# EAGLE design adaptateur_fusible_4N25V (EAGLE 6.5.0)
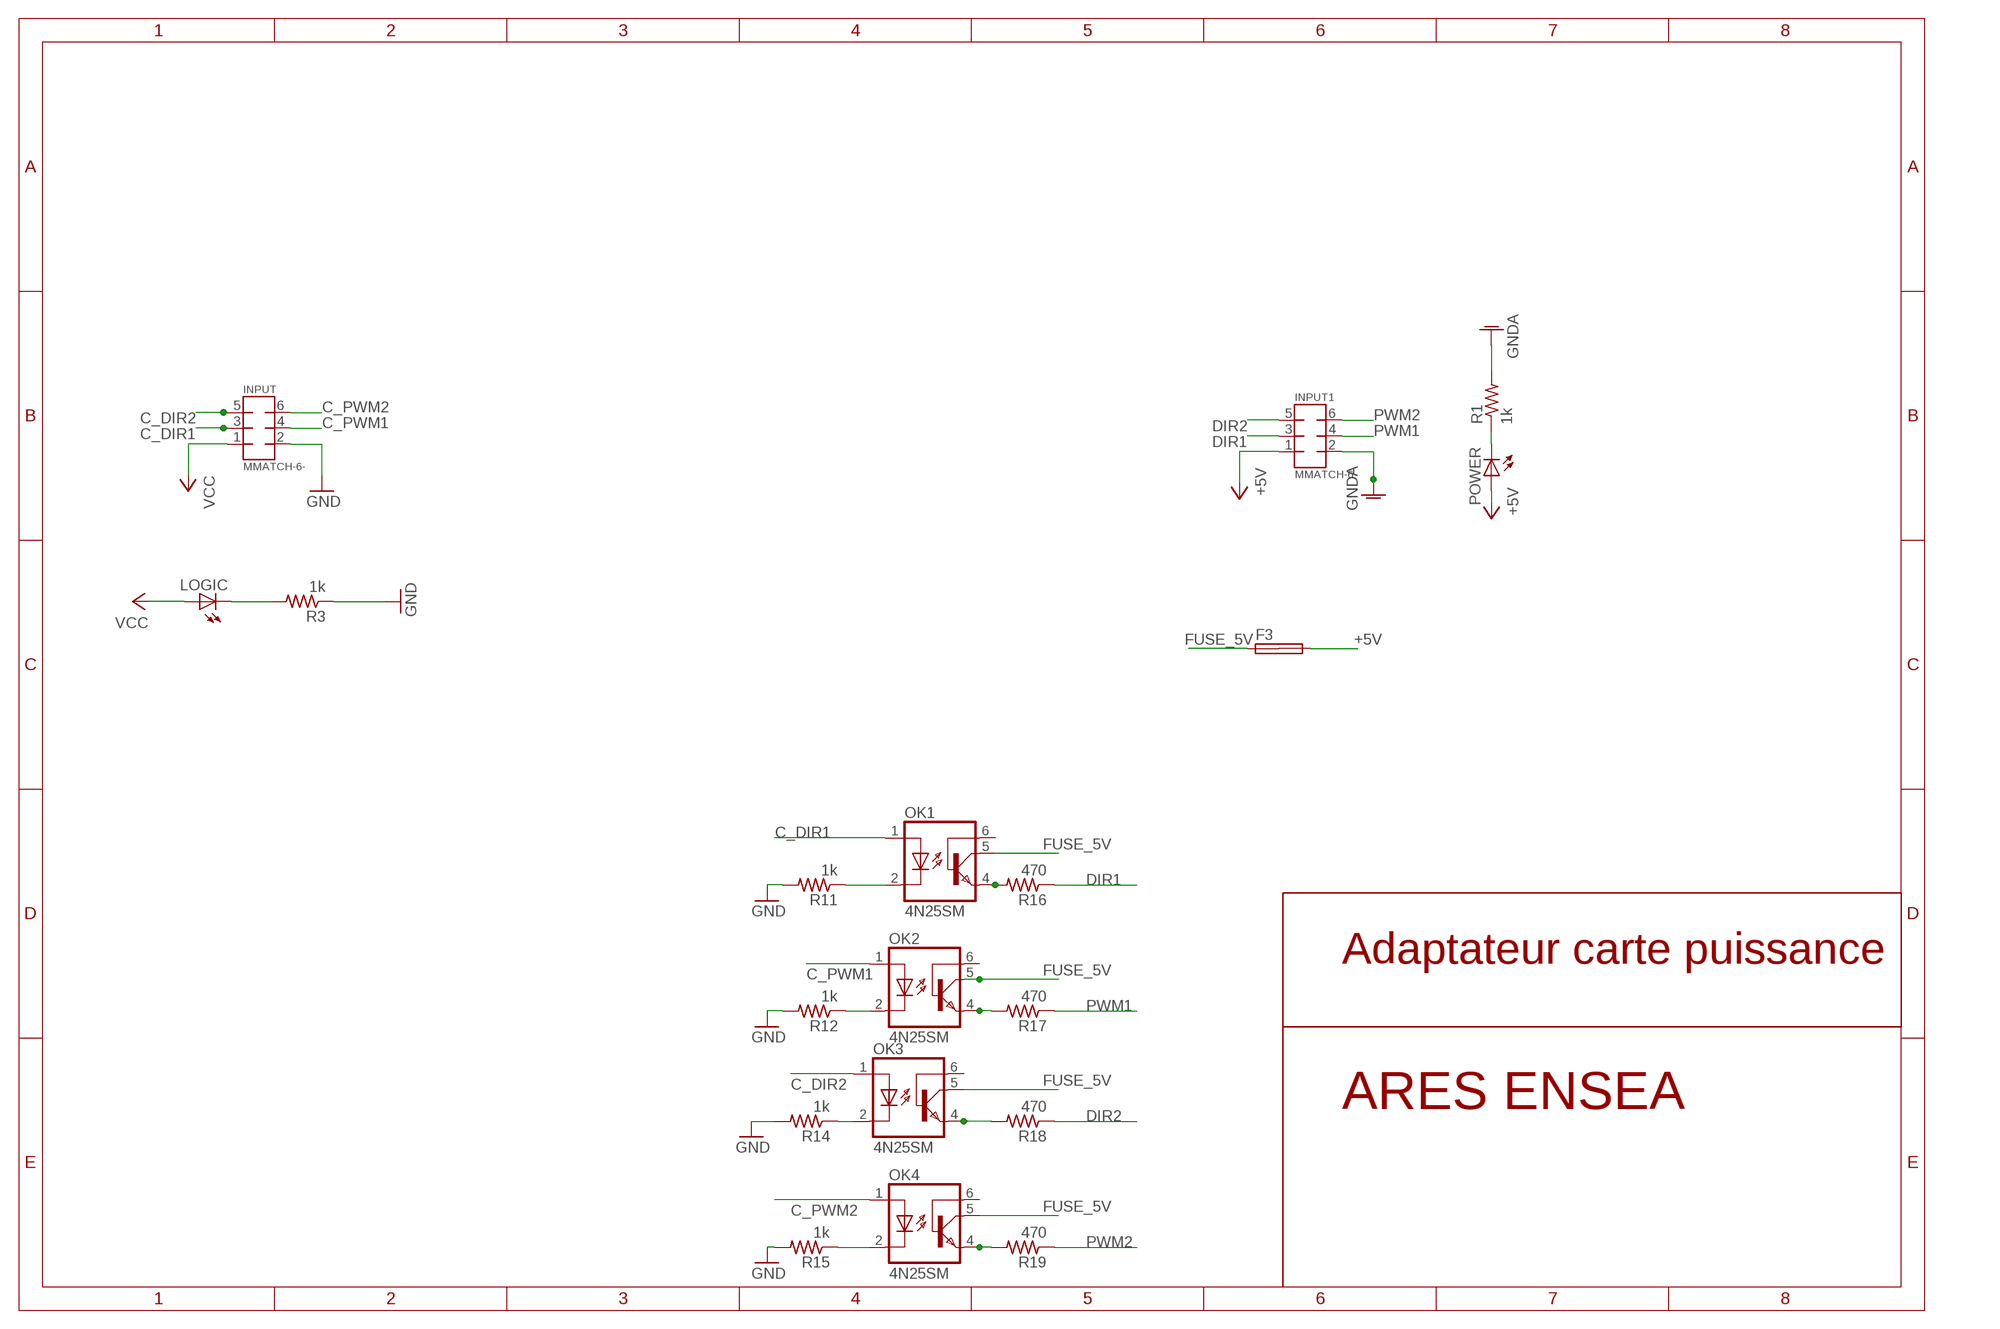
[diagram p0: schematic, sheet 1]

## Parts
F3  SHK20L  [SHK20L]
INPUT  MMATCH-6-  [AMP-215079-6]
INPUT1  MMATCH-6-  [AMP-215079-6]
LOGIC  LEDSML0805  [SML0805]
OK1  4N25SM  [DIL6-SMD]
OK2  4N25SM  [DIL6-SMD]
OK3  4N25SM  [DIL6-SMD]
OK4  4N25SM  [DIL6-SMD]
POWER  LEDSML0805  [SML0805]
R1  1k  R-US_M0805  [M0805]
R3  1k  R-US_M0805  [M0805]
R11  1k  R-US_M0805  [M0805]
R12  1k  R-US_M0805  [M0805]
R14  1k  R-US_M0805  [M0805]
R15  1k  R-US_M0805  [M0805]
R16  470  R-US_M0805  [M0805]
R17  470  R-US_M0805  [M0805]
R18  470  R-US_M0805  [M0805]
R19  470  R-US_M0805  [M0805]

## Nets
+5V: F3.2A INPUT1.1 POWER.A
C_DIR1: INPUT.3 OK1.1(A)
C_DIR2: INPUT.5 OK3.1(A)
C_PWM1: INPUT.4 OK2.1(A)
C_PWM2: INPUT.6 OK4.1(A)
DIR1: INPUT1.3 R16.1
DIR2: INPUT1.5 R18.1
FUSE_5V: F3.1A OK1.5(COL) OK2.5(COL) OK3.5(COL) OK4.5(COL)
GND: INPUT.2 R3.1 R11.2 R12.2 R14.2 R15.2
GNDA: INPUT1.2 R1.2
N$1: OK1.2(C) R11.1
N$2: OK2.2(C) R12.1
N$3: POWER.C R1.1
N$4: LOGIC.C R3.2
N$9: OK3.2(C) R14.1
N$10: OK4.2(C) R15.1
N$19: OK1.4(EMI) R16.2
N$20: OK2.4(EMI) R17.2
N$21: OK3.4(EMI) R18.2
N$22: OK4.4(EMI) R19.2
PWM1: INPUT1.4 R17.1
PWM2: INPUT1.6 R19.1
VCC: INPUT.1 LOGIC.A
Unconnected: F3.1B F3.2B OK1.6(BAS) OK2.6(BAS) OK3.6(BAS) OK4.6(BAS)

## Notes on the sheet
- Adaptateur carte puissance
- ARES ENSEA

## Library data of the parts
F3 = fuse:SHK20L: FUSE HOLDER 5 x 20 mm, SH contact, SHH1 Schukat, E1073 Buerklin; OC_FARNELL: unknown; OC_NEWARK: unknown
INPUT INPUT1 = jt-con-micromatch:MMATCH-6-*
LOGIC POWER = led:LED: LED OSRAM: - CHIPLED LG R971, LG N971, LY N971, LG Q971, LY Q971, LO R971, LY R971 LH N974, LH R974 LS Q976, LO Q976, LY Q976 LO Q996 - Hyper CHIPLED LW Q18S LB Q993, LB Q99A, LB R99A - SideLED LS A670, LO A670, LY A670, LG A670, LP A670 LB A673, LV A673, LT A673, LW A673 LH A674 LY A675 LS A676, LA A676, LO A676, LY A676, LW A676 LS A679, LY A679, LG A679 - Hyper Micro SIDELED® LS Y876, LA Y876, LO Y876, LY Y876 LT Y87S - SmartLED LW L88C, LW L88S LB L89C, LB L89S, LG L890 LS L89K, LO L89K, LY L89K LS L896, LA L896, LO L896, LY L896 - TOPLED LS T670, LO T670, LY T670, LG T670, LP T670 LSG T670, LSP T670, LSY T670, LOP T670, LYG T670 LG T671, LOG T671, LSG T671 LB T673, LV T673, LT T673, LW T673 LH T674 LS T676, LA T676, LO T676, LY T676, LB T676, LH T676, LSB T676, LW T676 LB T67C, LV T67C, LT T67C, LS T67K, LO T67K, LY T67K, LW E67C LS E67B, LA E67B, LO E67B, LY E67B, LB E67C, LV E67C, LT E67C LW T67C LS T679, LY T679, LG T679 LS T770, LO T770, LY T770, LG T770, LP T770 LB T773, LV T773, LT T773, LW T773 LH T774 LS E675, LA E675, LY E675, LS T675 LS T776, LA T776, LO T776, LY T776, LB T776 LHGB T686 LT T68C, LB T68C - Hyper Mini TOPLED® LB M676 - Mini TOPLED Santana® LG M470 LS M47K, LO M47K, LY M47K Source: http://www.osram.convergy.de LUXEON: - LUMILED® LXK2-PW12-R00, LXK2-PW12-S00, LXK2-PW14-U00, LXK2-PW14-V00 LXK2-PM12-R00, LXK2-PM12-S00, LXK2-PM14-U00 LXK2-PE12-Q00, LXK2-PE12-R00, LXK2-PE12-S00, LXK2-PE14-T00, LXK2-PE14-U00 LXK2-PB12-K00, LXK2-PB12-L00, LXK2-PB12-M00, LXK2-PB14-N00, LXK2-PB14-P00, LXK2-PB14-Q00 LXK2-PR12-L00, LXK2-PR12-M00, LXK2-PR14-Q00, LXK2-PR14-R00 LXK2-PD12-Q00, LXK2-PD12-R00, LXK2-PD12-S00 LXK2-PH12-R00, LXK2-PH12-S00 LXK2-PL12-P00, LXK2-PL12-Q00, LXK2-PL12-R00 Source: www.luxeon.com KINGBRIGHT: KA-3528ASYC Source: www.kingbright.com
OK1-OK4 = optocoupler:4N*?M: General Purpose 6-Pin Phototransistor Optocouplers Source: http://www.fairchildsemi.com/ds/4N/4N35-M.pdf; MF: FAIRCHILD SEMICONDUCTOR; MPN: 4N25SM; OC_FARNELL: 1021152; OC_NEWARK: 34C2020
R1 R3 R11 R12 R14-R19 = rcl:R-US_: RESISTOR, American symbol

## Board
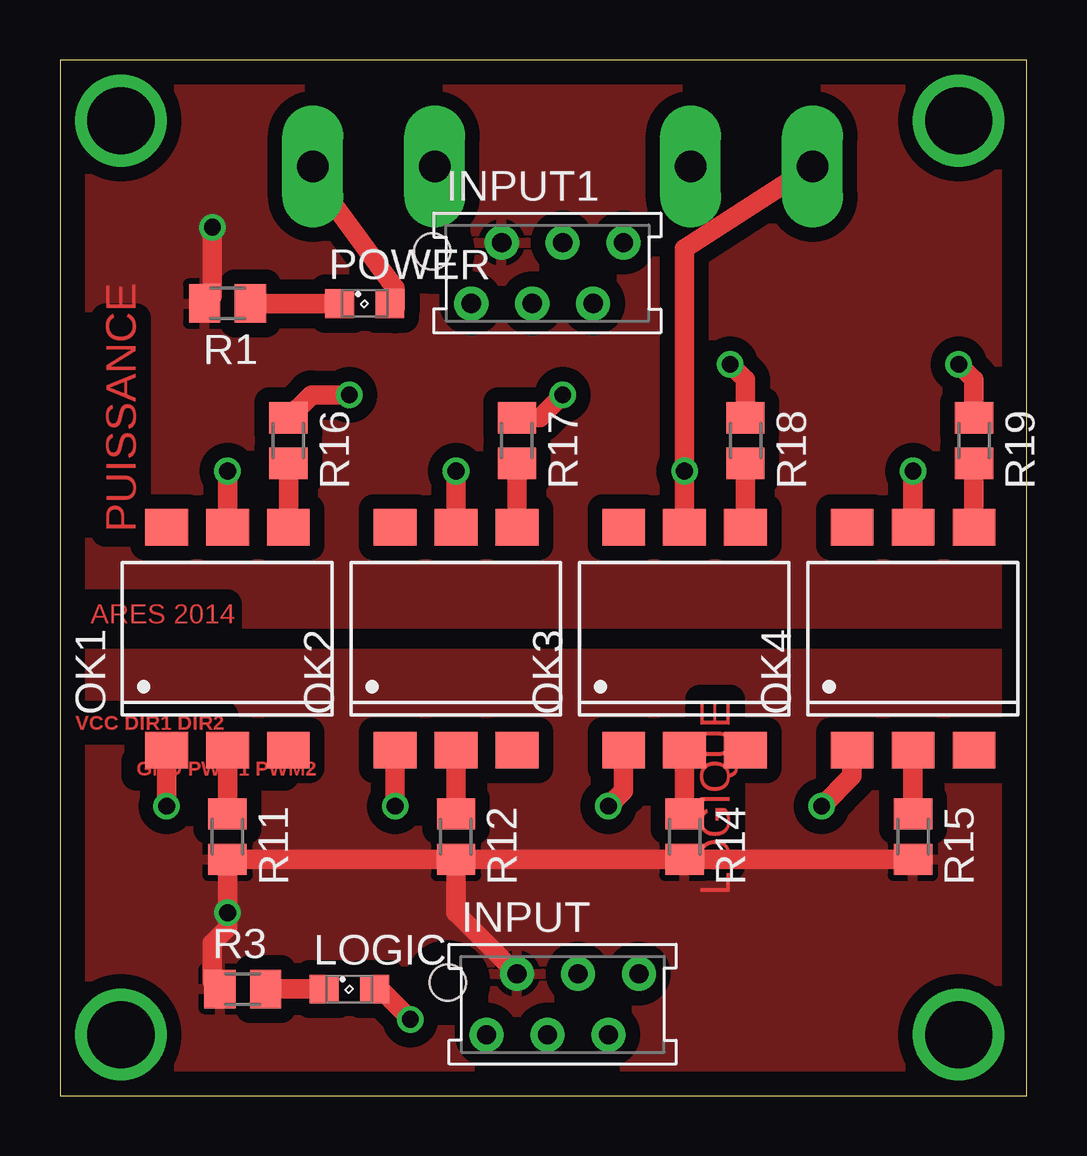
[diagram p1: board, top side]
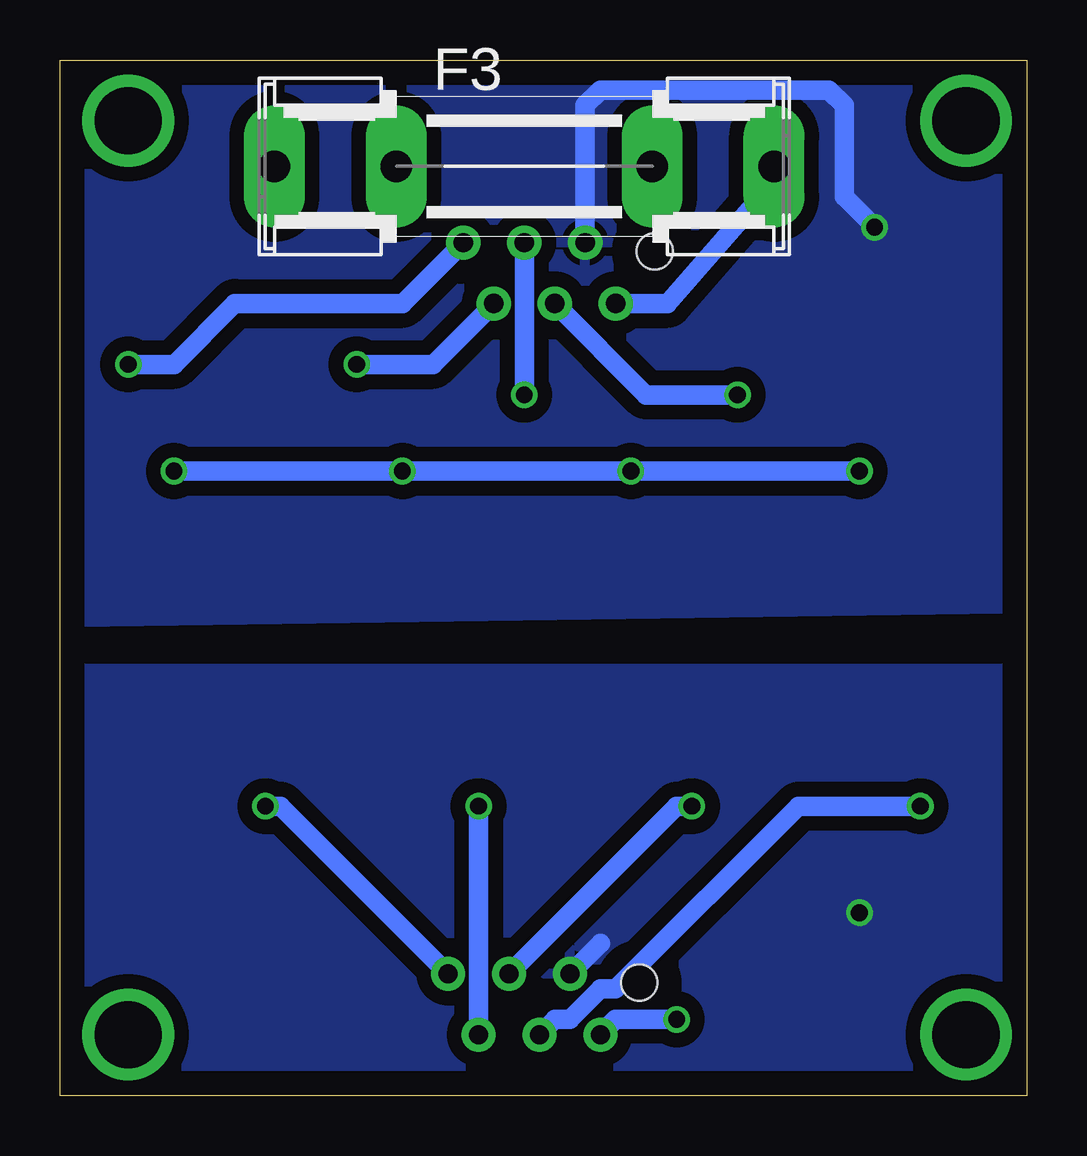
[diagram p2: board, bottom side, seen from below]

Size 40.31 x 43.17 mm. Coordinates in mm from the lower left corner, seen from the top.
Outline: 0,0 40.31,0 40.31,43.17 0,43.17 0,0
Copper layers (1*16): Top 0.035mm / dielectric 1.5mm / Bottom 0.035mm
Design rules "default *": minimum track width 0.4mm, minimum drill 0.8mm, track to track 0.3mm, track to pad 0.3mm, pad to pad 0.3mm, via to via 0.3mm, smd to smd 0.3mm, copper to edge 40mil, drill to drill 8mil, minimum pad ring 10mil, minimum via ring 8mil, stop-mask expansion 4mil, vias tented up to drill 0mil, thermal gap 10mil

### Footprints (pad centres in the part's own frame; a part is rotated, then mirrored left to right if it is on the bottom)
SHK20L = drill 1.321 pad 2.54 long: 1A -10.414,0; 1B -5.334,0; 2A 10.414,0; 2B 5.334,0
AMP-215079-6 = drill 0.8 pad 1.422: 1 0,0; 2 1.27,2.54; 3 2.54,0; 4 3.81,2.54; 5 5.08,0; 6 6.35,2.54 | hole 1.5: -1.62,2.175
SML0805 = smd 1.2 x 1.2: A 1.05,0; C -1.05,0
DIL6-SMD = smd 1.78 x 1.52: 1 -2.54,-4.645; 2 0,-4.645; 3 2.54,-4.645; 4 2.54,4.645; 5 0,4.645; 6 -2.54,4.645
M0805 = smd 1.3 x 1.6: 1 -0.95,0; 2 0.95,0

### Placement (x,y rotation side)
F3  20.95,38.73 0 bottom
INPUT  17.78,2.54 0 top
INPUT1  17.14,33.02 0 top
LOGIC  12.07,4.45 0 top
OK1  6.99,19.05 0 top
OK2  16.51,19.05 0 top
OK3  26.04,19.05 0 top
OK4  35.56,19.05 0 top
POWER  12.7,33.02 0 top
R1  6.99,33.02 180 top
R3  7.62,4.45 0 top
R11  6.99,10.79 270 top
R12  16.51,10.79 270 top
R14  26.04,10.79 270 top
R15  35.56,10.79 270 top
R16  9.52,27.3 270 top
R17  19.05,27.3 270 top
R18  28.57,27.3 270 top
R19  38.1,27.3 270 top

### Tracks (layer width: path | path; a pad name or v marks a point on that pad's centre or on a via)
+5V
  Top 0.813: F3.2A 10.54,38.35 13.97,33.66 13.97,32.8 POWER.A
  Bottom 0.813: INPUT1.1 14.99,33.02 10.54,38.1 F3.2A
C_DIR1  (via drill 0.7)
  Top 0.813: OK1.1 v4.45,12.06
  Bottom 0.813: v4.45,12.06 9.52,12.06 17.14,4.45 17.78,4.45 19.05,3.18 19.68,3.18 INPUT.3
C_DIR2  (via drill 0.7)
  Top 0.813: OK3.1 23.5,12.7 v22.86,12.06
  Bottom 0.813: v22.86,12.06 INPUT.5
C_PWM1  (via drill 0.7)
  Top 0.813: OK2.1 v13.97,12.06
  Bottom 0.813: v13.97,12.06 14.61,12.06 INPUT.4
C_PWM2  (via drill 0.7)
  Top 0.813: OK4.1 33.02,13.33 v31.75,12.06
  Bottom 0.813: v31.75,12.06 31.11,12.06 INPUT.6
DIR1  (via drill 0.7)
  Top 0.813: R16.1 10.48,29.21 v12.07,29.21
  Bottom 0.813: v12.07,29.21 15.88,29.21 INPUT1.3
DIR2  (via drill 0.7)
  Top 0.813: R18.1 28.57,29.85 v27.94,30.48
  Bottom 0.813: v27.94,30.48 24.77,30.48 INPUT1.5
FUSE_5V  (via drill 0.7)
  Top 0.813: F3.1A 26.04,35.31 v26.04,26.04 OK3.5 | OK4.5 v35.56,26.04 | OK2.5 v16.51,26.04 | v6.99,26.04 OK1.5
  Bottom 0.813: v35.56,26.04 v26.04,26.04 v16.51,26.04 v6.99,26.04
GND  (via drill 0.7)
  Top 0.813: R12.2 16.51,7.62 INPUT.2 | R12.2 R11.2 v6.99,7.62 6.99,6.98 6.35,6.35 6.35,4.76 R3.1 | R12.2 R14.2 R15.2
  Bottom 0.813: INPUT.2 17.78,6.35
  pour Top (isolate 0.61): -1.9,18.42 -3.17,-5.08 43.82,-5.08 42.55,18.42
  pour Bottom (isolate 0.61): -3.17,17.78 43.18,17.78 42.55,-5.08 -3.17,-5.08
GNDA  (via drill 0.7)
  Top 0.813: v6.35,36.2 6.35,33.34 R1.2
  Bottom 0.813: INPUT1.2 18.41,41.27 17.78,41.91 8.25,41.91 7.62,41.27 7.62,37.46 v6.35,36.2
  pour Bottom (isolate 0.61): -1.9,43.18 -1.9,20.32 42.55,19.69 41.28,43.18
  pour Top (isolate 0.61): -3.17,19.69 42.55,19.69 43.18,43.18 -2.54,43.81
N$1
  Top 0.813: OK1.2 R11.1
N$2
  Top 0.813: OK2.2 R12.1
N$3
  Top 0.813: R1.1 POWER.C
N$4
  Top 0.813: LOGIC.C R3.2
N$5  (via drill 2.8)
  other vias: 2.54,2.54
N$6  (via drill 2.8)
  other vias: 37.47,2.54
N$7  (via drill 2.8)
  other vias: 37.47,40.64
N$8  (via drill 2.8)
  other vias: 2.54,40.64
N$9
  Top 0.813: OK3.2 R14.1
N$10
  Top 0.813: OK4.2 R15.1
N$19
  Top 0.813: R16.2 OK1.4
N$20
  Top 0.813: R17.2 OK2.4
N$21
  Top 0.813: R18.2 OK3.4
N$22
  Top 0.813: R19.2 OK4.4
PWM1  (via drill 0.7)
  Top 0.813: R17.1 20,28.25 v20.95,29.21
  Bottom 0.813: v20.95,29.21 INPUT1.4
PWM2  (via drill 0.7)
  Top 0.813: R19.1 38.1,29.85 v37.47,30.48
  Bottom 0.813: v37.47,30.48 35.56,30.48 33.02,33.02 26.04,33.02 INPUT1.6
VCC  (via drill 0.7)
  Top 0.813: LOGIC.A 13.34,4.45 v14.61,3.18
  Bottom 0.813: v14.61,3.18 17.14,3.18 INPUT.1

### Text on the board
Top: PUISSANCE | ARES 2014 | LOGIQUE | VCC DIR1 DIR2 | GND PWM1 PWM2